# Altium schematic sheet led.SchDoc
size A4
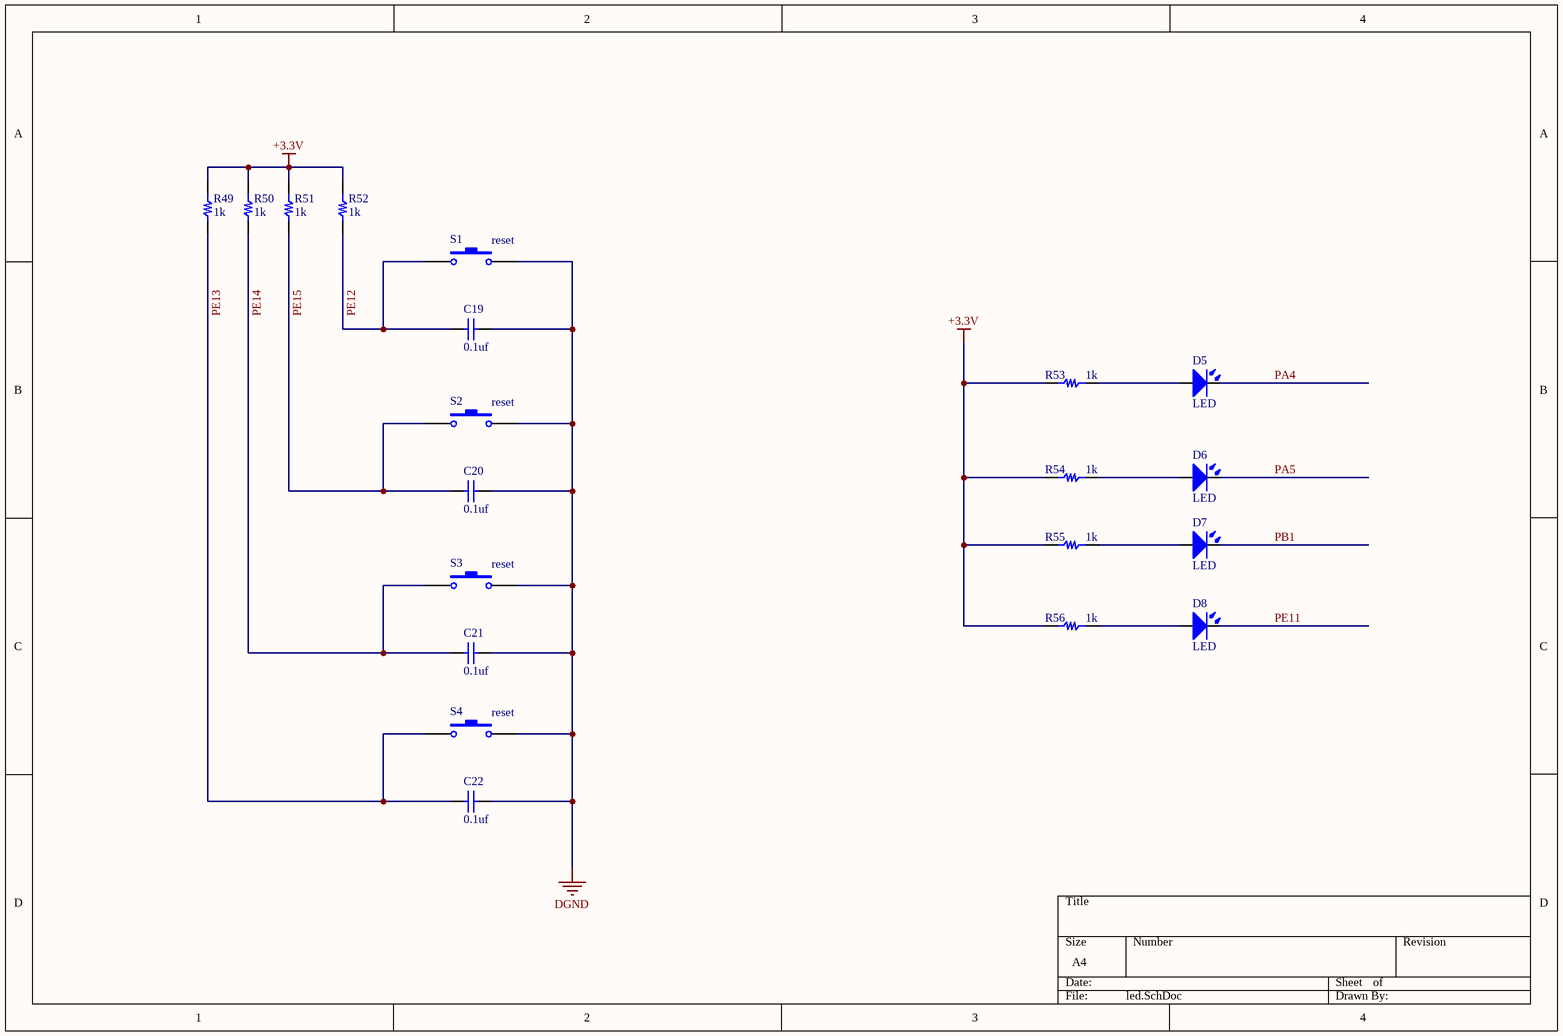
[diagram p0: led.SchDoc]

## Parts
C19  0.1uf  [0805C]
C20  0.1uf  [0805C]
C21  0.1uf  [0805C]
C22  0.1uf  [0805C]
D5  LED  [0805-LED-RED]
D6  LED  [0805-LED-RED]
D7  LED  [0805-LED-RED]
D8  LED  [0805-LED-RED]
R49  1k  [0805_small]
R50  1k  [0805_small]
R51  1k  [0805_small]
R52  1k  [0805_small]
R53  1k  [0805_small]
R54  1k  [0805_small]
R55  1k  [0805_small]
R56  1k  [0805_small]
S1  reset  [k_TS_021]
S2  reset  [k_TS_021]
S3  reset  [k_TS_021]
S4  reset  [k_TS_021]

## Nets
+3.3V: R49.1 R50.1 R51.1 R52.1 R53.2 R54.2 R55.2 R56.2
DGND: C19.1 C20.1 C21.1 C22.1 S1.2 S2.2 S3.2 S4.2
PA4: D5.2(K)
PA5: D6.2(K)
PB1: D7.2(K)
PE11: D8.2(K)
PE12: C19.2 R52.2 S1.1
PE13: C22.2 R49.2 S4.1
PE14: C21.2 R50.2 S3.1
PE15: C20.2 R51.2 S2.1
NetD5_1: D5.1(A) R53.1
NetD6_1: D6.1(A) R54.1
NetD7_1: D7.1(A) R55.1
NetD8_1: D8.1(A) R56.1

## Library data of the parts
C19-C22 = Cap: 贴片电容; Value: 100pF; Published: 8-Jun-2000; LatestRevisionDate: 17-Jul-2002; LatestRevisionNote: Re-released for DXP Platform.; PackageReference: RAD-0.3; Publisher: Altium Limited
D5-D8 = LED: Typical INFRARED GaAs LED; Published: 8-Jun-2000; LatestRevisionDate: 08-Jul-2005; LatestRevisionNote: Mech Layer 1 removed.; PackageReference: LED-0; Publisher: Altium Limited; PackageDescription: LED; 2 Leads
R49-R56 = Res: 电阻; Value: 230k; Published: 24-Mar-1999; LatestRevisionDate: 29-May-2009; LatestRevisionNote: IPC-7351 Footprint Added.; PackageVersion: Mar-2003; PackageReference: 6-0805; Publisher: Altium Limited; PackageDescription: Chip Resistor 0805 Case Size; Code_IPC: RESC2012
S1-S4 = SW-PB-2: Switch; Published: 24-Mar-1999; LatestRevisionDate: 17-Jul-2002; LatestRevisionNote: Re-released for DXP Platform.; PackageReference: SPST-2; Publisher: Altium Limited; PackageDescription: Switch; 2 Leads